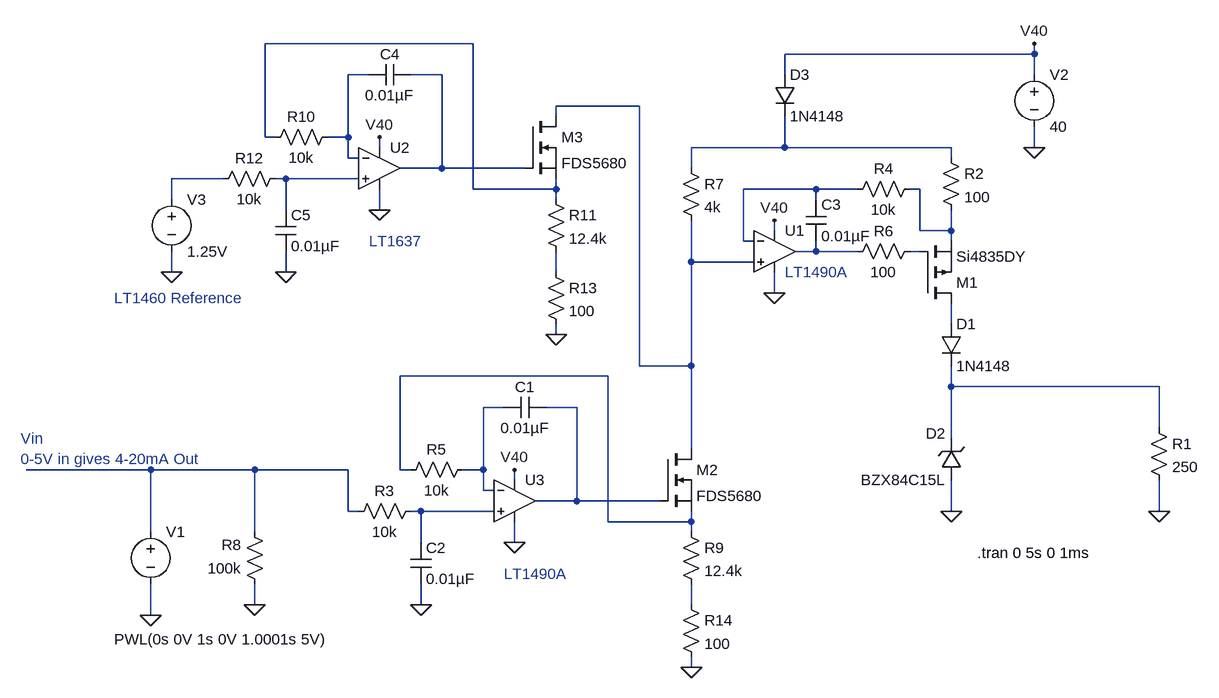
[diagram p0: schematic 4to20_1490A.asc]
4to20_1490A.asc, the LTspice schematic file:
Version 4
SHEET 1 3232 872
WIRE -912 -704 -1232 -704
WIRE -48 -688 -48 -704
WIRE -48 -688 -432 -688
WIRE -1072 -656 -1104 -656
WIRE -960 -656 -1008 -656
WIRE -432 -656 -432 -688
WIRE -48 -656 -48 -688
WIRE -656 -608 -784 -608
WIRE -784 -592 -784 -608
WIRE -1232 -560 -1232 -704
WIRE -1216 -560 -1232 -560
WIRE -1104 -560 -1104 -656
WIRE -1104 -560 -1136 -560
WIRE -1056 -544 -1056 -560
WIRE -432 -544 -432 -592
WIRE -432 -544 -576 -544
WIRE -176 -544 -432 -544
WIRE -48 -544 -48 -576
WIRE -1104 -528 -1104 -560
WIRE -1088 -528 -1104 -528
WIRE -176 -528 -176 -544
WIRE -960 -512 -960 -656
WIRE -960 -512 -1024 -512
WIRE -832 -512 -960 -512
WIRE -576 -512 -576 -544
WIRE -1296 -496 -1376 -496
WIRE -1200 -496 -1216 -496
WIRE -1088 -496 -1200 -496
WIRE -912 -480 -912 -704
WIRE -784 -480 -784 -496
WIRE -784 -480 -912 -480
WIRE -384 -480 -496 -480
WIRE -320 -480 -384 -480
WIRE -224 -480 -240 -480
WIRE -1376 -464 -1376 -496
WIRE -784 -464 -784 -480
WIRE -384 -464 -384 -480
WIRE -1200 -448 -1200 -496
WIRE -1056 -448 -1056 -480
WIRE -448 -416 -448 -432
WIRE -224 -416 -224 -480
WIRE -176 -416 -176 -448
WIRE -176 -416 -224 -416
WIRE -496 -400 -496 -480
WIRE -480 -400 -496 -400
WIRE -176 -400 -176 -416
WIRE -384 -384 -384 -400
WIRE -384 -384 -416 -384
WIRE -320 -384 -384 -384
WIRE -224 -384 -240 -384
WIRE -576 -368 -576 -432
WIRE -480 -368 -576 -368
WIRE -1376 -352 -1376 -384
WIRE -1200 -352 -1200 -384
WIRE -784 -352 -784 -384
WIRE -448 -320 -448 -352
WIRE -176 -272 -176 -304
WIRE -784 -256 -784 -272
WIRE -656 -208 -656 -608
WIRE -576 -208 -576 -368
WIRE -576 -208 -656 -208
WIRE -704 -192 -1024 -192
WIRE -176 -176 -176 -208
WIRE 144 -176 -176 -176
WIRE -864 -144 -896 -144
WIRE -752 -144 -800 -144
WIRE 144 -112 144 -176
WIRE -176 -96 -176 -176
WIRE -576 -80 -576 -208
WIRE -1408 -48 -1600 -48
WIRE -1248 -48 -1408 -48
WIRE -1104 -48 -1248 -48
WIRE -1024 -48 -1024 -192
WIRE -1008 -48 -1024 -48
WIRE -896 -48 -896 -144
WIRE -896 -48 -928 -48
WIRE -848 -32 -848 -48
WIRE -896 -16 -896 -48
WIRE -880 -16 -896 -16
WIRE -752 0 -752 -144
WIRE -752 0 -816 0
WIRE -624 0 -752 0
WIRE -1104 16 -1104 -48
WIRE -1088 16 -1104 16
WIRE -992 16 -1008 16
WIRE -880 16 -992 16
WIRE -176 16 -176 -32
WIRE 144 16 144 -32
WIRE -704 32 -704 -192
WIRE -576 32 -576 16
WIRE -576 32 -704 32
WIRE -1408 48 -1408 -48
WIRE -1248 48 -1248 -48
WIRE -576 48 -576 32
WIRE -992 64 -992 16
WIRE -848 64 -848 32
WIRE -1248 160 -1248 128
WIRE -992 160 -992 128
WIRE -576 160 -576 128
WIRE -1408 176 -1408 128
WIRE -576 256 -576 240
FLAG 144 16 0
FLAG -48 -544 0
FLAG -848 64 0
FLAG -48 -704 V40
FLAG -848 -48 V40
FLAG -992 160 0
FLAG -1408 176 0
FLAG -1248 160 0
FLAG -176 16 0
FLAG -448 -320 0
FLAG -448 -432 V40
FLAG -576 256 0
FLAG -1056 -448 0
FLAG -1056 -560 V40
FLAG -1200 -352 0
FLAG -784 -256 0
FLAG -1376 -352 0
SYMBOL res 128 -128 R0
SYMATTR InstName R1
SYMATTR Value 250
SYMBOL voltage -48 -672 R0
SYMATTR InstName V2
SYMATTR Value 40
SYMBOL res -912 -64 R90
WINDOW 0 0 56 VBottom 2
WINDOW 3 32 56 VTop 2
SYMATTR InstName R5
SYMATTR Value 10k
SYMBOL res -192 -544 R0
SYMATTR InstName R2
SYMATTR Value 100
SYMBOL cap -864 -128 R270
WINDOW 0 32 32 VTop 2
WINDOW 3 0 32 VBottom 2
SYMATTR InstName C1
SYMATTR Value 0.01µF
SYMBOL pmos -224 -304 M180
SYMATTR InstName M1
SYMATTR Value Si4835DY
SYMBOL cap -1008 64 R0
SYMATTR InstName C2
SYMATTR Value 0.01µF
SYMBOL voltage -1408 32 R0
WINDOW 123 0 0 Left 2
WINDOW 39 0 0 Left 2
WINDOW 3 -56 181 Left 2
SYMATTR Value PWL(0s 0V 1s 0V 1.0001s 5V)
SYMATTR InstName V1
SYMBOL diode -192 -272 R0
SYMATTR InstName D1
SYMATTR Value 1N4148
SYMBOL res -592 -528 R0
SYMATTR InstName R7
SYMATTR Value 4k
SYMBOL res -1232 144 R180
WINDOW 0 36 76 Left 2
WINDOW 3 36 40 Left 2
SYMATTR InstName R8
SYMATTR Value 100k
SYMBOL zener -160 -32 R180
WINDOW 0 24 72 Left 2
WINDOW 3 24 0 Left 2
SYMATTR InstName D2
SYMATTR Value BZX84C15L
SYMATTR Description Diode
SYMATTR Type diode
SYMBOL diode -448 -656 R0
SYMATTR InstName D3
SYMATTR Value 1N4148
SYMBOL res -224 -496 R90
WINDOW 0 0 56 VBottom 2
WINDOW 3 32 56 VTop 2
SYMATTR InstName R4
SYMATTR Value 10k
SYMBOL res -224 -400 R90
WINDOW 0 0 56 VBottom 2
WINDOW 3 32 56 VTop 2
SYMATTR InstName R6
SYMATTR Value 100
SYMBOL cap -400 -464 R0
SYMATTR InstName C3
SYMATTR Value 0.01µF
SYMBOL nmos -624 -80 R0
SYMATTR InstName M2
SYMATTR Value FDS5680
SYMBOL res -592 32 R0
SYMATTR InstName R9
SYMATTR Value 12.4k
SYMBOL res -1104 32 R270
WINDOW 0 32 56 VTop 2
WINDOW 3 0 56 VBottom 2
SYMATTR InstName R3
SYMATTR Value 10k
SYMBOL opamps\\UniversalOpamp2 -848 0 R0
SYMATTR InstName U3
SYMBOL opamps\\UniversalOpamp2 -448 -384 R0
SYMATTR InstName U1
SYMBOL res -1120 -576 R90
WINDOW 0 0 56 VBottom 2
WINDOW 3 32 56 VTop 2
SYMATTR InstName R10
SYMATTR Value 10k
SYMBOL cap -1072 -640 R270
WINDOW 0 32 32 VTop 2
WINDOW 3 0 32 VBottom 2
SYMATTR InstName C4
SYMATTR Value 0.01µF
SYMBOL cap -1216 -448 R0
SYMATTR InstName C5
SYMATTR Value 0.01µF
SYMBOL nmos -832 -592 R0
SYMATTR InstName M3
SYMATTR Value FDS5680
SYMBOL res -800 -480 R0
SYMATTR InstName R11
SYMATTR Value 12.4k
SYMBOL res -1312 -480 R270
WINDOW 0 32 56 VTop 2
WINDOW 3 0 56 VBottom 2
SYMATTR InstName R12
SYMATTR Value 10k
SYMBOL opamps\\UniversalOpamp2 -1056 -512 R0
SYMATTR InstName U2
SYMBOL voltage -1376 -480 R0
WINDOW 123 0 0 Left 2
WINDOW 39 0 0 Left 2
SYMATTR InstName V3
SYMATTR Value 1.25V
SYMBOL res -800 -368 R0
SYMATTR InstName R13
SYMATTR Value 100
SYMBOL res -592 144 R0
SYMATTR InstName R14
SYMATTR Value 100
TEXT -136 80 Left 2 !.tran 0 5s 0 1ms
TEXT -864 112 Left 2 ;LT1490A
TEXT -432 -352 Left 2 ;LT1490A
TEXT -1072 -400 Left 2 ;LT1637
TEXT -1464 -312 Left 2 ;LT1460 Reference
TEXT -1608 -96 Left 2 ;Vin\n0-5V in gives 4-20mA Out

The netlist it stands for:
* 4to20_1490A.asc
R1 N015 0 250
V2 V40 0 40
R5 N016 N014 10k
R2 N005 N009 100
C1 N016 N017 0.01µF
M1 N013 N011 N009 N009 Si4835DY
C2 N019 0 0.01µF
V1 N018 0 PWL(0s 0V 1s 0V 1.0001s 5V)
D1 N013 N015 1N4148
R7 N005 N004 4k
R8 0 N018 100k
D2 0 N015 BZX84C15L
D3 V40 N005 1N4148
R4 N009 N008 10k
R6 N011 N010 100
C3 N008 N010 0.01µF
M2 N004 N017 N014 N014 FDS5680
R9 N014 N020 12.4k
R3 N018 N019 10k
XU3 N019 N016 V40 0 N017 level.2 Avol=1Meg GBW=10Meg Slew=10Meg ilimit=25m rail=0 Vos=0 phimargin=45 en=0 enk=0 in=0 ink=0 Rin=500Meg  ; pins IN+ IN- V+ V- OUT
XU1 N004 N008 V40 0 N010 level.2 Avol=1Meg GBW=10Meg Slew=10Meg ilimit=25m rail=0 Vos=0 phimargin=45 en=0 enk=0 in=0 ink=0 Rin=500Meg  ; pins IN+ IN- V+ V- OUT
R10 N002 N001 10k
C4 N002 N003 0.01µF
C5 N007 0 0.01µF
M3 N004 N003 N001 N001 FDS5680
R11 N001 N012 12.4k
R12 N006 N007 10k
XU2 N007 N002 V40 0 N003 level.2 Avol=1Meg GBW=10Meg Slew=10Meg ilimit=25m rail=0 Vos=0 phimargin=45 en=0 enk=0 in=0 ink=0 Rin=500Meg  ; pins IN+ IN- V+ V- OUT
V3 N006 0 1.25V
R13 N012 0 100
R14 N020 0 100
.model D D
.lib standard.dio
.model NMOS NMOS
.model PMOS PMOS
.lib standard.mos
.tran 0 5s 0 1ms
* LT1490A
* LT1490A
* LT1637
* LT1460 Reference
* Vin
* 0-5V in gives 4-20mA Out
.lib UniversalOpamps2.sub
.backanno
.end